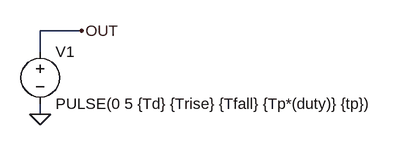
[diagram p0: schematic VCLK.asc]
VCLK.asc, the LTspice schematic file:
Version 4
SHEET 1 884 680
WIRE 224 96 160 96
WIRE 160 128 160 96
WIRE 160 224 160 208
FLAG 160 224 0
FLAG 224 96 OUT
SYMBOL voltage 160 112 R0
WINDOW 123 0 0 Left 0
WINDOW 39 0 0 Left 0
SYMATTR InstName V1
SYMATTR Value PULSE(0 5 {Td} {Trise} {Tfall} {Tp*(duty)} {tp})

The netlist it stands for:
* VCLK.asc
V1 OUT 0 PULSE(0 5 {Td} {Trise} {Tfall} {Tp*(duty)} {tp})
.backanno
.end